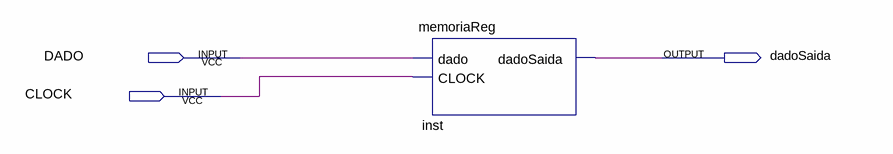
[diagram p0: schematic sheet]
// Quartus schematic MemReg.bdf as structural Verilog: 1 symbols, 3 pins
module MemReg (
  input  DADO,
  input  CLOCK,
  output dadoSaida
);

  memoriaReg inst (.dado(DADO), .CLOCK(CLOCK), .dadoSaida(dadoSaida));
endmodule
